# EasyEDA Pro project ProProject_【常亮24天】 低功耗-迷你桌面时钟_2024-08-04.epro, schematic 桌面便携时钟4.0.4-控制板
Create Date: 2024-03-14; Page Name: STC32F方案; Project Name: 【常亮24天】 低功耗-迷你桌面时钟; Schematic Name: 桌面便携时钟4.0.4-控制板; Update Date: 2024-03-14; Company: 嘉立创EDA; Drawed: 联重的鸢崎; Page Size: A3; Version: V4.0
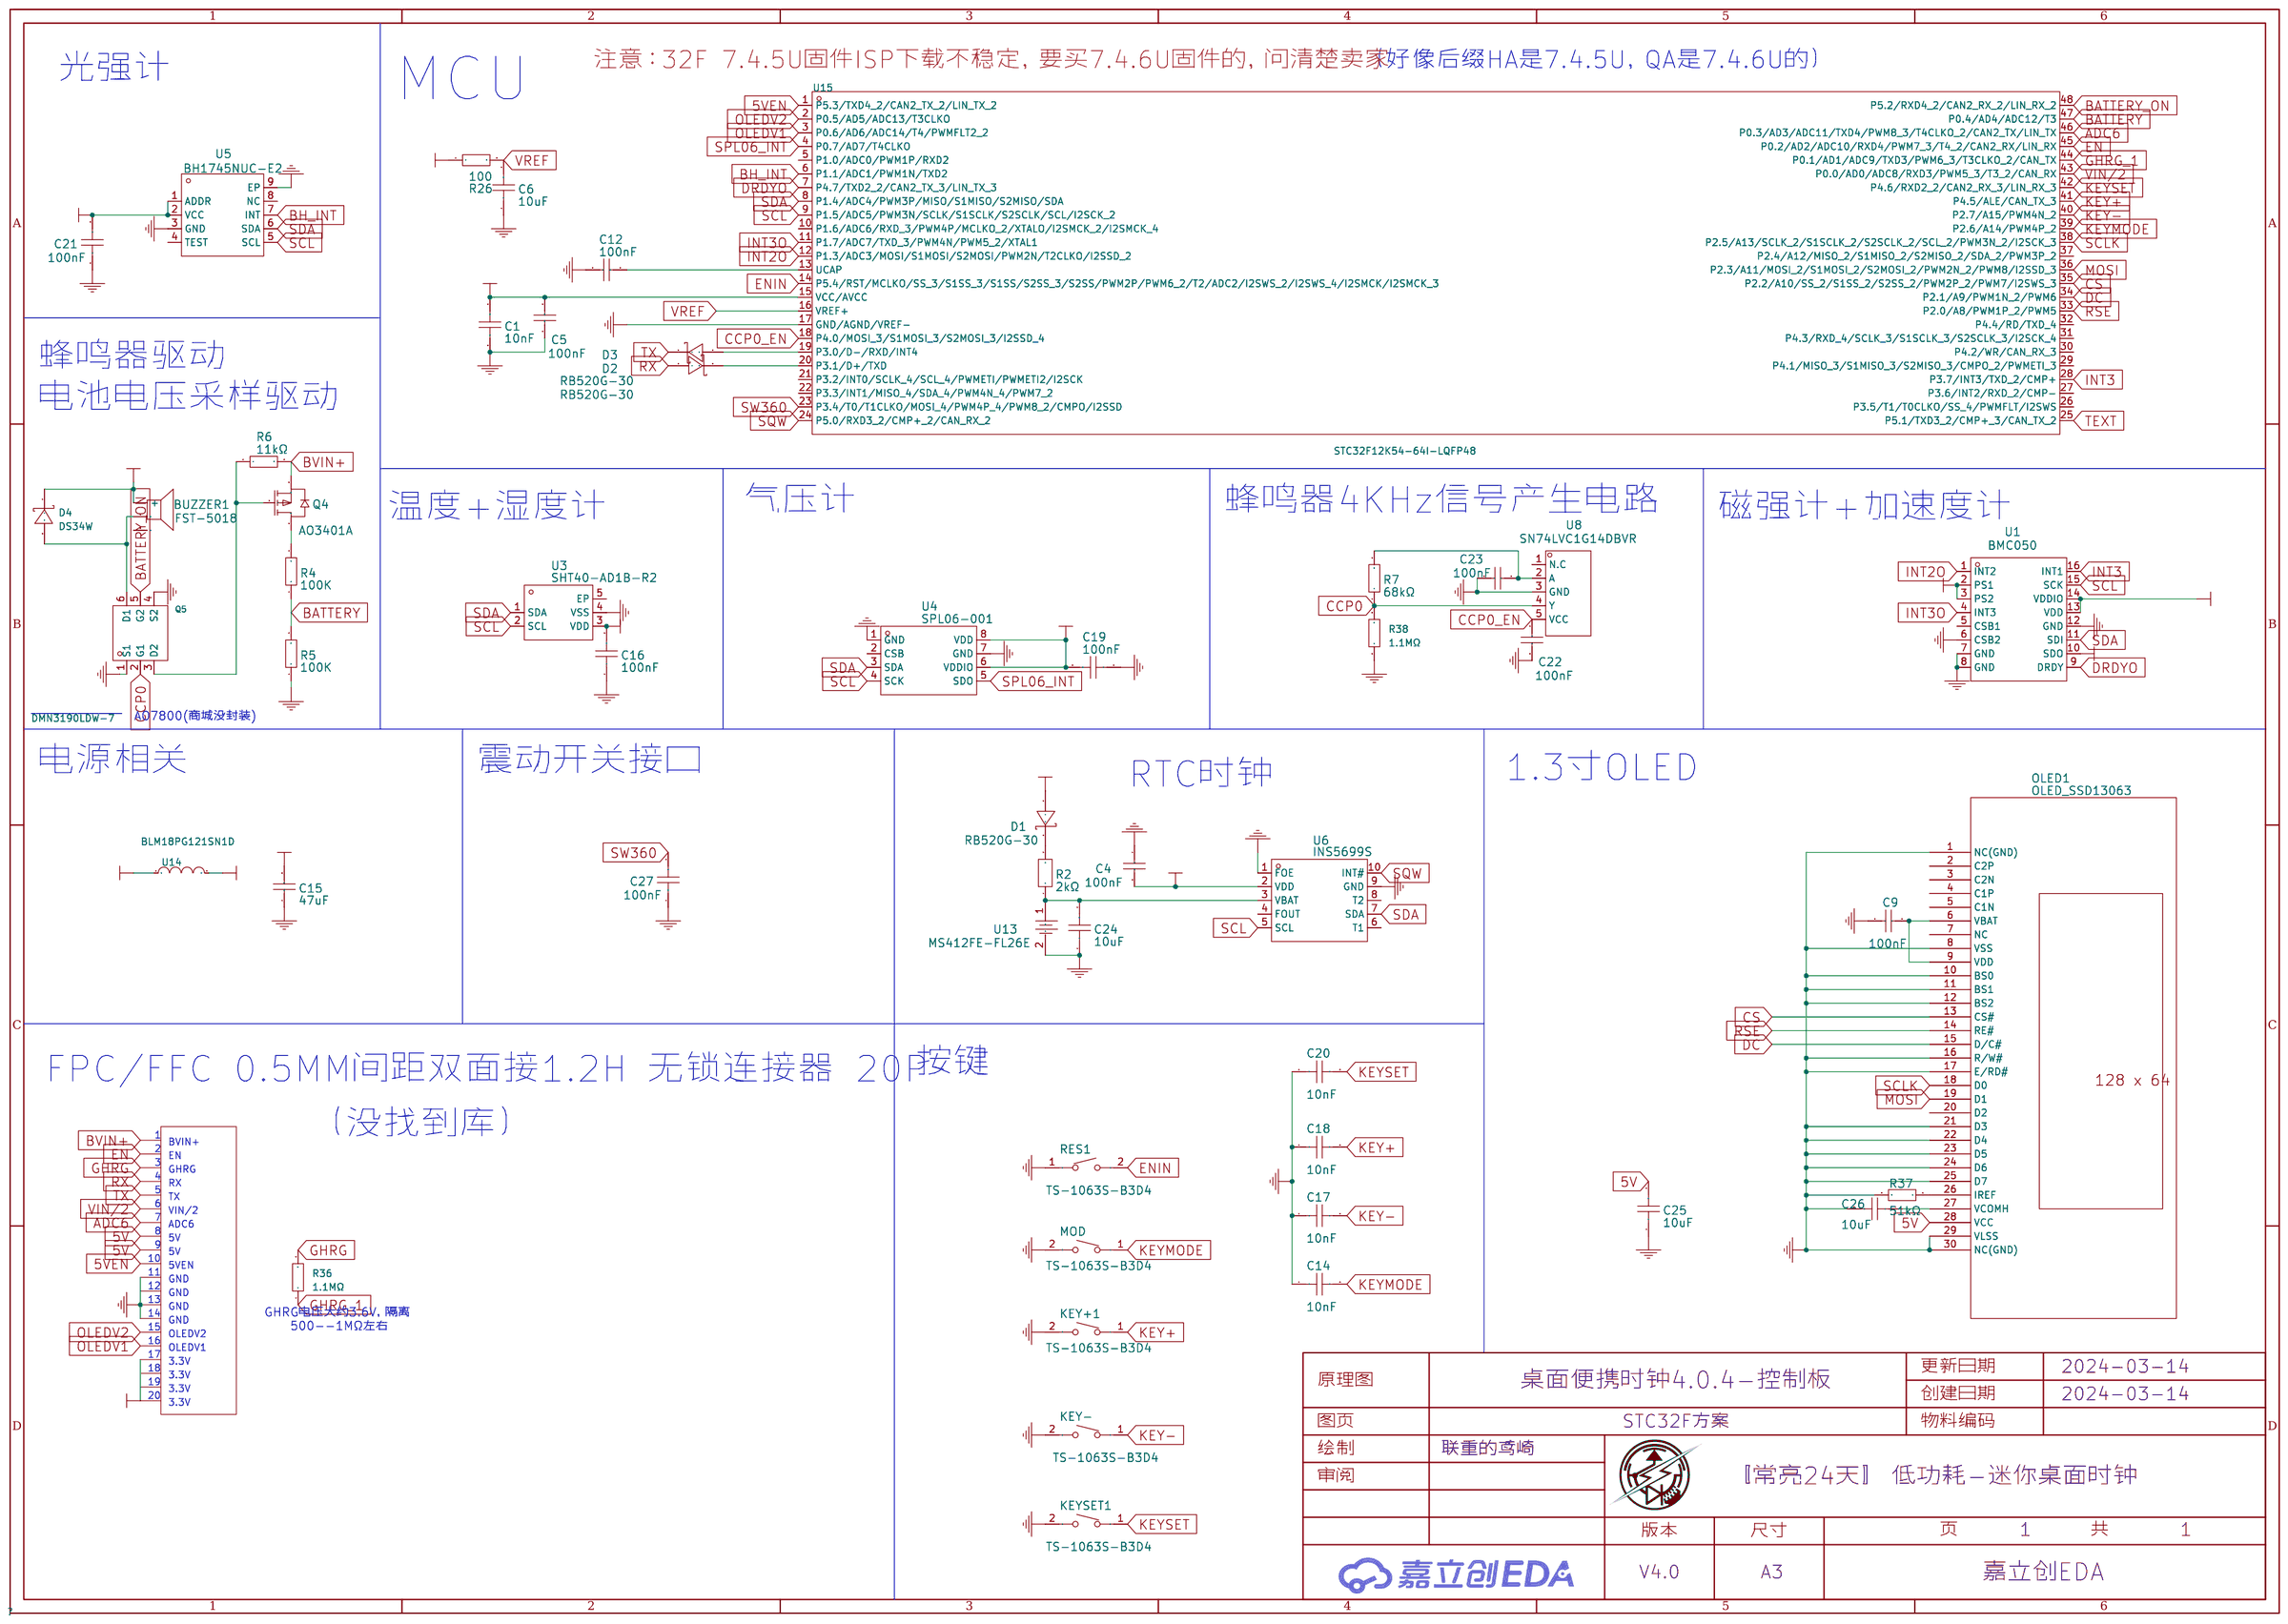
[diagram p1: schematic sheet]

## Parts
BUZZER1  FST-5018  [BUZ-SMD_FST-5018]
C1  10nF  [C0402]
C4  100nF  [C0402]
C5  100nF  [C0402]
C6  10uF  [C0402]
C9  100nF  [C0402]
C12  100nF  [C0402]
C14  10nF  [C0402]
C15  47uF  [C1210]
C16  100nF  [C0402]
C17  10nF  [C0402]
C18  10nF  [C0402]
C19  100nF  [C0402]
C20  10nF  [C0402]
C21  100nF  [C0402]
C22  100nF  [C0402]
C23  100nF  [C0402]
C24  10uF  [C0402]
C25  10uF  [C0402]
C26  10uF  [C0402]
C27  100nF  [C0402]
D1  RB520G-30  [SOD-723_L1.7-W1.0-P1.42-RD]
D2  RB520G-30  [SOD-723_L1.7-W1.0-P1.42-RD]
D3  RB520G-30  [SOD-723_L1.7-W1.0-P1.42-RD]
D4  DS34W  [SOD-123FL_L2.7-W1.8-LS3.8-RD]
KEY+1  TS-1063S-B3D4  [KEY-SMD_L3.0-W2.5-LS4.0_TS-1603S]
KEY-  TS-1063S-B3D4  [KEY-SMD_L3.0-W2.5-LS4.0_TS-1603S]
KEYSET1  TS-1063S-B3D4  [KEY-SMD_L3.0-W2.5-LS4.0_TS-1603S]
MOD  TS-1063S-B3D4  [KEY-SMD_L3.0-W2.5-LS4.0_TS-1603S]
OLED1  OLED_SSD13063  [OLED_SSD1306_1.3]
Q4  AO3401A  [SOT-23_L2.9-W1.3-P0.95-LS2.4-BR]
Q5  DMN3190LDW-7  [SC-70-6_L2.2-W1.3-P0.65-LS2.1-BL]
R2  2kΩ  [R0402]
R4  100K  [R0402]
R5  100K  [R0402]
R6  11kΩ  [R0402]
R7  68kΩ  [R0402]
R26  100  [R0402]
R36  1.1MΩ  [R0402]
R37  51kΩ  [R0402]
R38  1.1MΩ  [R0402]
RES1  TS-1063S-B3D4  [KEY-SMD_L3.0-W2.5-LS4.0_TS-1603S]
U1  BMC050  [LGA-16_L3.0-W3.0-P0.50-TL-1]
U3  SHT40-AD1B-R2  [DFN-4_L1.5-W1.5-P0.8]
U4  SPL06-001  [SENSOR-SMD_SPL06-001]
U5  BH1745NUC-E2  [WSON-8_L2.0-W2.0-P0.50-TL-EP]
U6  INS5699S  [SMD-10_L3.2-W2.5-P0.70-BL_DAPU_INS5699S]
U8  SN74LVC1G14DBVR  [SOT-23-5_L3.0-W1.7-P0.95-LS2.8-BR]
U13  MS412FE-FL26E  [BAT-SMD_MS412FE-FL26E]
U14  BLM18PG121SN1D  [L0603]
U15  STC32F12K54-64I-LQFP48  [LQFP-48_L7.0-W7.0-P0.50-LS9.0-BL]

## Library data of the parts
BUZZER1 = FST-5018: Supplier: LCSC; Supplier Part: C391028; Manufacturer: FUET; JLCPCB Part Class: Extended Part
C1 C14 C17 C18 C20 = CC0402KRX7R7BB103: Supplier: LCSC; Supplier Part: C327009; Manufacturer: YAGEO; JLCPCB Part Class: Extended Part
C4 C5 C9 C12 C22 C23 = CC0402KRX5R7BB104: Supplier: LCSC; Supplier Part: C106204; Manufacturer: YAGEO; JLCPCB Part Class: Extended Part
C6 C24-C26 = LDK105CBJ106MVLF: Supplier: LCSC; Supplier Part: C386033; Manufacturer: Taiyo Yuden; JLCPCB Part Class: Extended Part
C15 = LMK325BJ476MM-T: Supplier: LCSC; Manufacturer: TAIYO YUDEN; Supplier Part: C92824
C16 C19 C21 C27 = CC0402KRX5R6BB104: Supplier: LCSC; Supplier Part: C129131; Manufacturer: YAGEO; JLCPCB Part Class: Extended Part
D1-D3 = RB520G-30: Supplier: LCSC; Manufacturer: CJ(江苏长电/长晶); Supplier Part: C8525; JLCPCB Part Class: Extended Part
D4 = DS34W: 直流反向耐压(Vr):40V;平均整流电流(Io):3A;正向压降(Vf):550mV@3A;; LCSC Part Name: 40V 3A 550mV@3A; Supplier Part: C475668; Manufacturer: SHIKUES(时科); Supplier Footprint: SOD-123FL; JLCPCB Part Class: Extended Part; Datasheet: https://atta.szlcsc.com/upload/public/pdf/source/20200113/C475668_6F5D64B390F718EFB2A870E34C979DAF.pdf; Supplier: LCSC; Reverse Voltage (Vr): 40V; Average Rectified Current (Io): 3A; Forward Voltage (Vf@If): 550mV@3A
KEY+1 KEY- KEYSET1 MOD RES1 = TS-1063S-B3D4: Supplier: LCSC; Supplier Part: C498291; Manufacturer: Yuandi; JLCPCB Part Class: Extended Part
OLED1 = UG-2864KSWLG01: Supplier: LCSC; Manufacturer: UG; Supplier Part: C113322
Q4 = AO3401A: Supplier: LCSC; Supplier Part: C347476; Manufacturer: Youtai Semiconductor Co., Ltd.
Q5 = DMN3190LDW-7: 类型:2个N沟道;漏源电压(Vdss):30V;连续漏极电流(Id):1A;功率(Pd):320mW;导通电阻(RDS(on)@Vgs,Id):190mΩ@10V,1.3A;; LCSC Part Name: 2个N沟道 耐压:30V 电流:1A; Supplier Part: C154750; Manufacturer: DIODES(美台); Supplier Footprint: SOT-363-6(SC-70-6); JLCPCB Part Class: 扩展库; Datasheet: https://atta.szlcsc.com/upload/public/pdf/source/20171221/C154750_15138395263561195847.pdf; Supplier: LCSC; Type: 2个N沟道; Drain Source Voltage (Vdss): 30V; Continuous Drain Current (Id): 1A; Power Dissipation (Pd): 320mW; Drain Source On Resistance (RDS(on)@Vgs,Id): 190mΩ@10V,1.3A; Gate Threshold Voltage (Vgs(th)@Id): 2.8V@250uA; Total Gate Charge (Qg@Vgs): 2nC@10V; Input Capacitance (Ciss@Vds): 87pF@20V; Operating Temperature: -55℃~+150℃@(Tj)
R2 = ERA2AED202X: Supplier: LCSC; Supplier Part: C336808; Manufacturer: PANASONIC; Resistance: 2K; JLCPCB Part Class: Extended Part
R4 R5 = CR0402-JW-224GLF: Supplier: LCSC; Supplier Part: C203142; Manufacturer: BOURNS; JLCPCB Part Class: Extended Part; Resistance: 220kΩ
R6 R7 = ERJ2RKF6802X: Supplier: LCSC; Supplier Part: C77607; Manufacturer: PANASONIC; Resistance: 68K; JLCPCB Part Class: Extended Part
R26 = AC0402FR-07100RL: Supplier: LCSC; Supplier Part: C144808; Manufacturer: YAGEO; JLCPCB Part Class: Extended Part
R36 R38 = RTT021104FTH: 电阻类型:厚膜电阻;阻值:1.1MΩ;精度:±1%;功率:62.5mW;最大工作电压:50V;温度系数:±100ppm/℃;; LCSC Part Name: 厚膜电阻 1.1MΩ ±1% 62.5mW; Supplier Part: C159143; Manufacturer: RALEC(旺诠); Supplier Footprint: 0402; JLCPCB Part Class: Extended Part; Datasheet: https://atta.szlcsc.com/upload/public/pdf/source/20191219/C158410_884373A5B7E1BC76BF57BC45A946C093.pdf; Supplier: LCSC; Type: 厚膜电阻; Tolerance: ±1%; Power(Watts): 62.5mW; Overload Voltage (Max): 50V; Temperature Coefficient: ±100ppm/℃; Operating Temperature Range: -55℃~+155℃
R37 = 0402WGF5102TCE: Supplier: LCSC; Manufacturer: UNI-ROYAL(厚声); Supplier Part: C25794; Resistance: 51K; JLCPCB Part Class: Basic Part
U1 = BMC050: Supplier: LCSC; Supplier Part: C2937159; Manufacturer: null; JLCPCB Part Class: Extended Part
U3 = SHT40-AD1B-R2: Supplier: LCSC; Supplier Part: C2909890; Manufacturer: Sensirion(瑞士盛思锐); JLCPCB Part Class: Extended Part
U4 = SPL06-001: Supplier: LCSC; Supplier Part: C2684428; Manufacturer: Goertek(歌尔); JLCPCB Part Class: Extended Part
U5 = BH1745NUC-E2: Supplier: LCSC; Supplier Part: C2837801; Manufacturer: ROHM(罗姆); JLCPCB Part Class: Extended Part
U6 = INS5699S: Supplier: LCSC; Supplier Part: C2924605; Manufacturer: DAPU(大普通信); JLCPCB Part Class: Extended Part
U8 = SN74LVC1G14DBVR: Supplier: LCSC; Manufacturer: TI(德州仪器); Supplier Part: C7835; JLCPCB Part Class: Extended Part
U13 = MS412FE-FL26E: Supplier: LCSC; Supplier Part: C47262; Manufacturer: Seiko(精工); JLCPCB Part Class: Extended Part
U14 = BLM18PG121SN1D: 标称阻抗@测试频率:120Ω@100MHz;误差:±25%;直流电阻(RDC):50mΩ;额定电流:2A;电路数:1;; LCSC Part Name: 120Ω@100MHz ±25%; Supplier Part: C14709; Manufacturer: muRata(村田); Supplier Footprint: 0603; JLCPCB Part Class: 扩展库; Datasheet: https://atta.szlcsc.com/upload/public/pdf/source/20130704/1457706621134.pdf; Supplier: LCSC; Impedance @ Frequency: 120Ω@100MHz; Tolerance: ±25%; DC Resistance: 50mΩ; Current Rating: 2A; Circuits: 1
U15 = STC32F12K54-64I-LQFP48: Supplier Part: C7430197; Manufacturer: STC(宏晶); Supplier Footprint: LQFP-48(7x7); JLCPCB Part Class: 扩展库; Datasheet: https://atta.szlcsc.com/upload/public/pdf/source/20230914/EE84BFAB73746799BFCD977324263BA5.pdf; Supplier: LCSC

## Nets
5V: C25.2 OLED1.28(VCC)
5VEN: U15.1(P5.3/TXD4_2/CAN2_TX_2/LIN_TX_2)
GND: C1.2 C4.1 C5.2 C6.1 C9.1 C12.2 C14.1 C15.1 C16.1 C17.1 C18.1 C19.1 C20.1 C21.1 C22.2 C23.1 C24.1 C25.1 C26.2 C27.1 KEY+1.2 KEY-.2 KEYSET1.2 MOD.2 OLED1.1(NC(GND)) OLED1.8(VSS) OLED1.10(BS0) OLED1.11(BS1) OLED1.12(BS2) OLED1.16(R/W#) OLED1.17(E/RD#) OLED1.21(D3) OLED1.22(D4) OLED1.23(D5) OLED1.24(D6) OLED1.25(D7) OLED1.29(VLSS) OLED1.30(NC(GND)) Q5.1(S1) Q5.4(S2) R5.1 R37.2 R38.1 RES1.1 U1.6(CSB2) U1.7(GND) U1.8(GND) U1.12(GND) U3.4(VSS) U4.1(GND) U4.7(GND) U5.3(GND) U5.9(EP) U6.1(FOE) U6.9(GND) U8.3(GND) U13.2 U15.17(GND/AGND/VREF-)
3.3: BUZZER1.1(+) C1.1 C4.2 C5.1 C15.2 C16.2 C19.2 C21.2 D1.1(A) D4.1(K) R26.1 U1.2(PS1) U1.3(PS2) U1.10(SDO) U1.13(VDD) U1.14(VDDIO) U3.3(VDD) U4.6(VDDIO) U4.8(VDD) U5.1(ADDR) U5.2(VCC) U6.2(VDD) U14.2 U15.15(VCC/AVCC)
3.3_INT: U14.1
ADC6: U15.46(P0.3/AD3/ADC11/TXD4/PWM8_3/T4CLKO_2/CAN2_TX/LIN_TX)
BATTERY: R4.1 R5.2 U15.47(P0.4/AD4/ADC12/T3)
BATTERY_ON: Q5.5(G2) U15.48(P5.2/RXD4_2/CAN2_RX_2/LIN_RX_2)
BH_INT: U5.7(INT) U15.6(P1.1/ADC1/PWM1N/TXD2)
BVIN+: Q4.2(S) R6.2
CCP0: Q5.2(G1) R7.1 R38.2 U8.4(Y)
CCP0_EN: C22.1 U8.5(VCC) U15.18(P4.0/MOSI_3/S1MOSI_3/S2MOSI_3/I2SSD_4)
CS: OLED1.13(CS#) U15.35(P2.2/A10/SS_2/S1SS_2/S2SS_2/PWM2P_2/PWM7/I2SWS_3)
DC: OLED1.15(D/C#) U15.34(P2.1/A9/PWM1N_2/PWM6)
DRDYO: U1.9(DRDY) U15.7(P4.7/TXD2_2/CAN2_TX_3/LIN_TX_3)
EN: U15.45(P0.2/AD2/ADC10/RXD4/PWM7_3/T4_2/CAN2_RX/LIN_RX)
ENIN: RES1.2 U15.14(P5.4/RST/MCLKO/SS_3/S1SS_3/S1SS/S2SS_3/S2SS/PWM2P/PWM6_2/T2/ADC2/I2SWS_2/I2SWS_4/I2SMCK/I2SMCK_3)
GHRG: R36.2
GHRG_1: R36.1 U15.44(P0.1/AD1/ADC9/TXD3/PWM6_3/T3CLKO_2/CAN_TX)
INT2O: U1.1(INT2) U15.12(P1.3/ADC3/MOSI/S1MOSI/S2MOSI/PWM2N/T2CLKO/I2SSD_2)
INT3: U1.16(INT1) U15.28(P3.7/INT3/TXD_2/CMP+)
INT3O: U1.4(INT3) U15.11(P1.7/ADC7/TXD_3/PWM4N/PWM5_2/XTAL1)
KEY+: C18.2 KEY+1.1 U15.41(P4.5/ALE/CAN_TX_3)
KEY-: C17.2 KEY-.1 U15.40(P2.7/A15/PWM4N_2)
KEYMODE: C14.2 MOD.1 U15.39(P2.6/A14/PWM4P_2)
KEYSET: C20.2 KEYSET1.1 U15.42(P4.6/RXD2_2/CAN2_RX_3/LIN_RX_3)
MOSI: OLED1.19(D1) U15.36(P2.3/A11/MOSI_2/S1MOSI_2/S2MOSI_2/PWM2N_2/PWM8/I2SSD_3)
OLEDV1: U15.3(P0.6/AD6/ADC14/T4/PWMFLT2_2)
OLEDV2: U15.2(P0.5/AD5/ADC13/T3CLKO)
RSE: OLED1.14(RE#) U15.33(P2.0/A8/PWM1P_2/PWM5)
RX: D2.1(A)
SCL: U1.15(SCK) U3.2(SCL) U4.4(SCK) U5.5(SCL) U6.5(SCL) U15.9(P1.5/ADC5/PWM3N/SCLK/S1SCLK/S2SCLK/SCL/I2SCK_2)
SCLK: OLED1.18(D0) U15.38(P2.5/A13/SCLK_2/S1SCLK_2/S2SCLK_2/SCL_2/PWM3N_2/I2SCK_3)
SDA: U1.11(SDI) U3.1(SDA) U4.3(SDA) U5.6(SDA) U6.7(SDA) U15.8(P1.4/ADC4/PWM3P/MISO/S1MISO/S2MISO/SDA)
SPL06_INT: U4.5(SDO) U15.4(P0.7/AD7/T4CLKO)
SQW: U6.10(INT#) U15.24(P5.0/RXD3_2/CMP+_2/CAN_RX_2)
SW360: C27.2 U15.23(P3.4/T0/T1CLKO/MOSI_4/PWM4P_4/PWM8_2/CMPO/I2SSD)
TEXT: U15.25(P5.1/TXD3_2/CMP+_3/CAN_TX_2)
TX: D3.2(K)
VIN/2: U15.43(P0.0/AD0/ADC8/RXD3/PWM5_3/T3_2/CAN_RX)
VREF: C6.2 R26.2 U15.16(VREF+)
$1N379: C26.1 OLED1.27(VCOMH)
$1N1002: C23.2 R7.2 U8.2(A)
$1N1213: C9.2 OLED1.6(VBAT) OLED1.9(VDD)
$1N32098: C12.1 U15.13(UCAP)
$1N32104: D2.2(K) U15.20(P3.1/D+/TXD)
$1N50115: BUZZER1.2 D4.2(A) Q5.6(D1)
$1N50119: Q4.1(G) Q5.3(D2) R6.1
$1N50124: Q4.3(D) R4.2
$1N56259: D3.1(A) U15.19(P3.0/D-/RXD/INT4)
$1N64340: OLED1.26(IREF) R37.1
Net-(C24-2): C24.2 R2.1 U6.3(VBAT) U13.1
Net-(D1-2): D1.2(K) R2.2

Not connected (* = marked no-connect by the designer): BUZZER1 3; OLED1 2(C2P) 3(C2N) 4(C1P) 5(C1N) 7(NC) 20(D2); U1 5(CSB1); U3 5(EP); U4 2(CSB); U5 4(TEST) 8(NC); U6 4(FOUT) 6(T1) 8(T2); U8 1(N.C); U15 5(P1.0/ADC0/PWM1P/RXD2) 10(P1.6/ADC6/RXD_3/PWM4P/MCLKO_2/XTALO/I2SMCK_2/I2SMCK_4) 21(P3.2/INT0/SCLK_4/SCL_4/PWMETI/PWMETI2/I2SCK) 22(P3.3/INT1/MISO_4/SDA_4/PWM4N_4/PWM7_2) 26(P3.5/T1/T0CLKO/SS_4/PWMFLT/I2SWS) 27(P3.6/INT2/RXD_2/CMP-) 29(P4.1/MISO_3/S1MISO_3/S2MISO_3/CMPO_2/PWMETI_3) 30(P4.2/WR/CAN_RX_3) 31(P4.3/RXD_4/SCLK_3/S1SCLK_3/S2SCLK_3/I2SCK_4) 32(P4.4/RD/TXD_4) 37(P2.4/A12/MISO_2/S1MISO_2/S2MISO_2/SDA_2/PWM3P_2)

## Notes on the sheet
- 注意：32F 7.4.5U固件ISP下载不稳定，要买7.4.6U固件的，问清楚卖家
- （好像后缀HA是7.4.5U，QA是7.4.6U的）
- 光强计
- MCU
- 蜂鸣器驱动
- 电池电压采样驱动
- 气压计
- 蜂鸣器4KHz信号产生电路
- 温度+湿度计
- 磁强计+加速度计
- _______
- AO7800(商城没封装)
- 电源相关
- 震动开关接口
- RTC时钟
- 1.3寸OLED
- FPC/FFC 0.5MM间距双面接1.2H 无锁连接器 20P
- 按键
- 1
- BVIN+
- （没找到库）
- 2
- EN
- 3
- 4
- GHRG
- 5
- RX
- 6
- TX
- 7
- ADC6
- VIN/2
- 8
- 5V
- 10
- 9
- 5V
- 11
- 5VEN
- 12
- GND
- 13
- GND
- GND
- 14
- GND
- 15
- OLEDV2
- GHRG电压大约3.6V，隔离
      500--1MΩ左右
- 16
- 17
- OLEDV1
- 18
- 3.3V
- 19
- 3.3V
- 20
- 3.3V
- 3.3V
